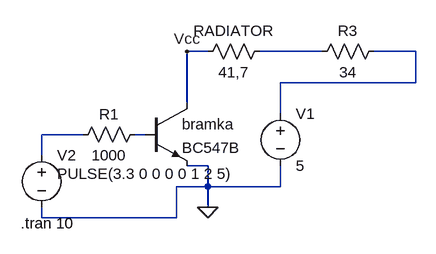
[diagram p0: schematic Draft1.asc]
Draft1.asc, the LTspice schematic file:
Version 4
SHEET 1 880 680
WIRE 256 64 224 64
WIRE 432 64 336 64
WIRE 576 64 512 64
WIRE 576 112 576 64
WIRE 576 112 368 112
WIRE 224 144 224 64
WIRE 368 160 368 112
WIRE 64 192 0 192
WIRE 160 192 144 192
WIRE 0 224 0 192
WIRE 256 240 224 240
WIRE 256 272 256 240
WIRE 256 272 208 272
WIRE 368 272 368 240
WIRE 368 272 256 272
WIRE 256 304 256 272
WIRE 0 320 0 304
WIRE 208 320 208 272
WIRE 208 320 0 320
FLAG 256 304 0
FLAG 224 64 Vcc
SYMBOL res 160 176 R90
WINDOW 0 0 56 VBottom 2
WINDOW 3 32 56 VTop 2
SYMATTR InstName R1
SYMATTR Value 1000
SYMBOL npn 160 144 R0
SYMATTR InstName bramka
SYMATTR Value BC547B
SYMBOL voltage 368 144 R0
WINDOW 123 0 0 Left 0
WINDOW 39 0 0 Left 0
SYMATTR InstName V1
SYMATTR Value 5
SYMBOL res 352 48 R90
WINDOW 0 0 56 VBottom 2
WINDOW 3 32 56 VTop 2
SYMATTR InstName RADIATOR
SYMATTR Value 41,7
SYMBOL voltage 0 208 R0
WINDOW 123 24 72 Left 2
WINDOW 39 0 0 Left 0
WINDOW 3 24 44 Left 2
SYMATTR Value PULSE(3.3 0 0 0 0 1 2 5)
SYMATTR InstName V2
SYMBOL res 528 48 R90
WINDOW 0 0 56 VBottom 2
WINDOW 3 32 56 VTop 2
SYMATTR InstName R3
SYMATTR Value 34
TEXT -32 328 Left 2 !.tran 10

The netlist it stands for:
* Draft1.asc
R1 N004 N003 1000
Q§bramka Vcc N004 0 0 BC547B
V1 N002 0 5
RADIATOR N001 Vcc 41,7
V2 N003 0 PULSE(3.3 0 0 0 0 1 2 5)
R3 N002 N001 34
.model NPN NPN
.model PNP PNP
.lib standard.bjt
.tran 10
.backanno
.end